# EAGLE design espnative-deadrail-2-g-rendered-poly-via (EAGLE 7.6.0)
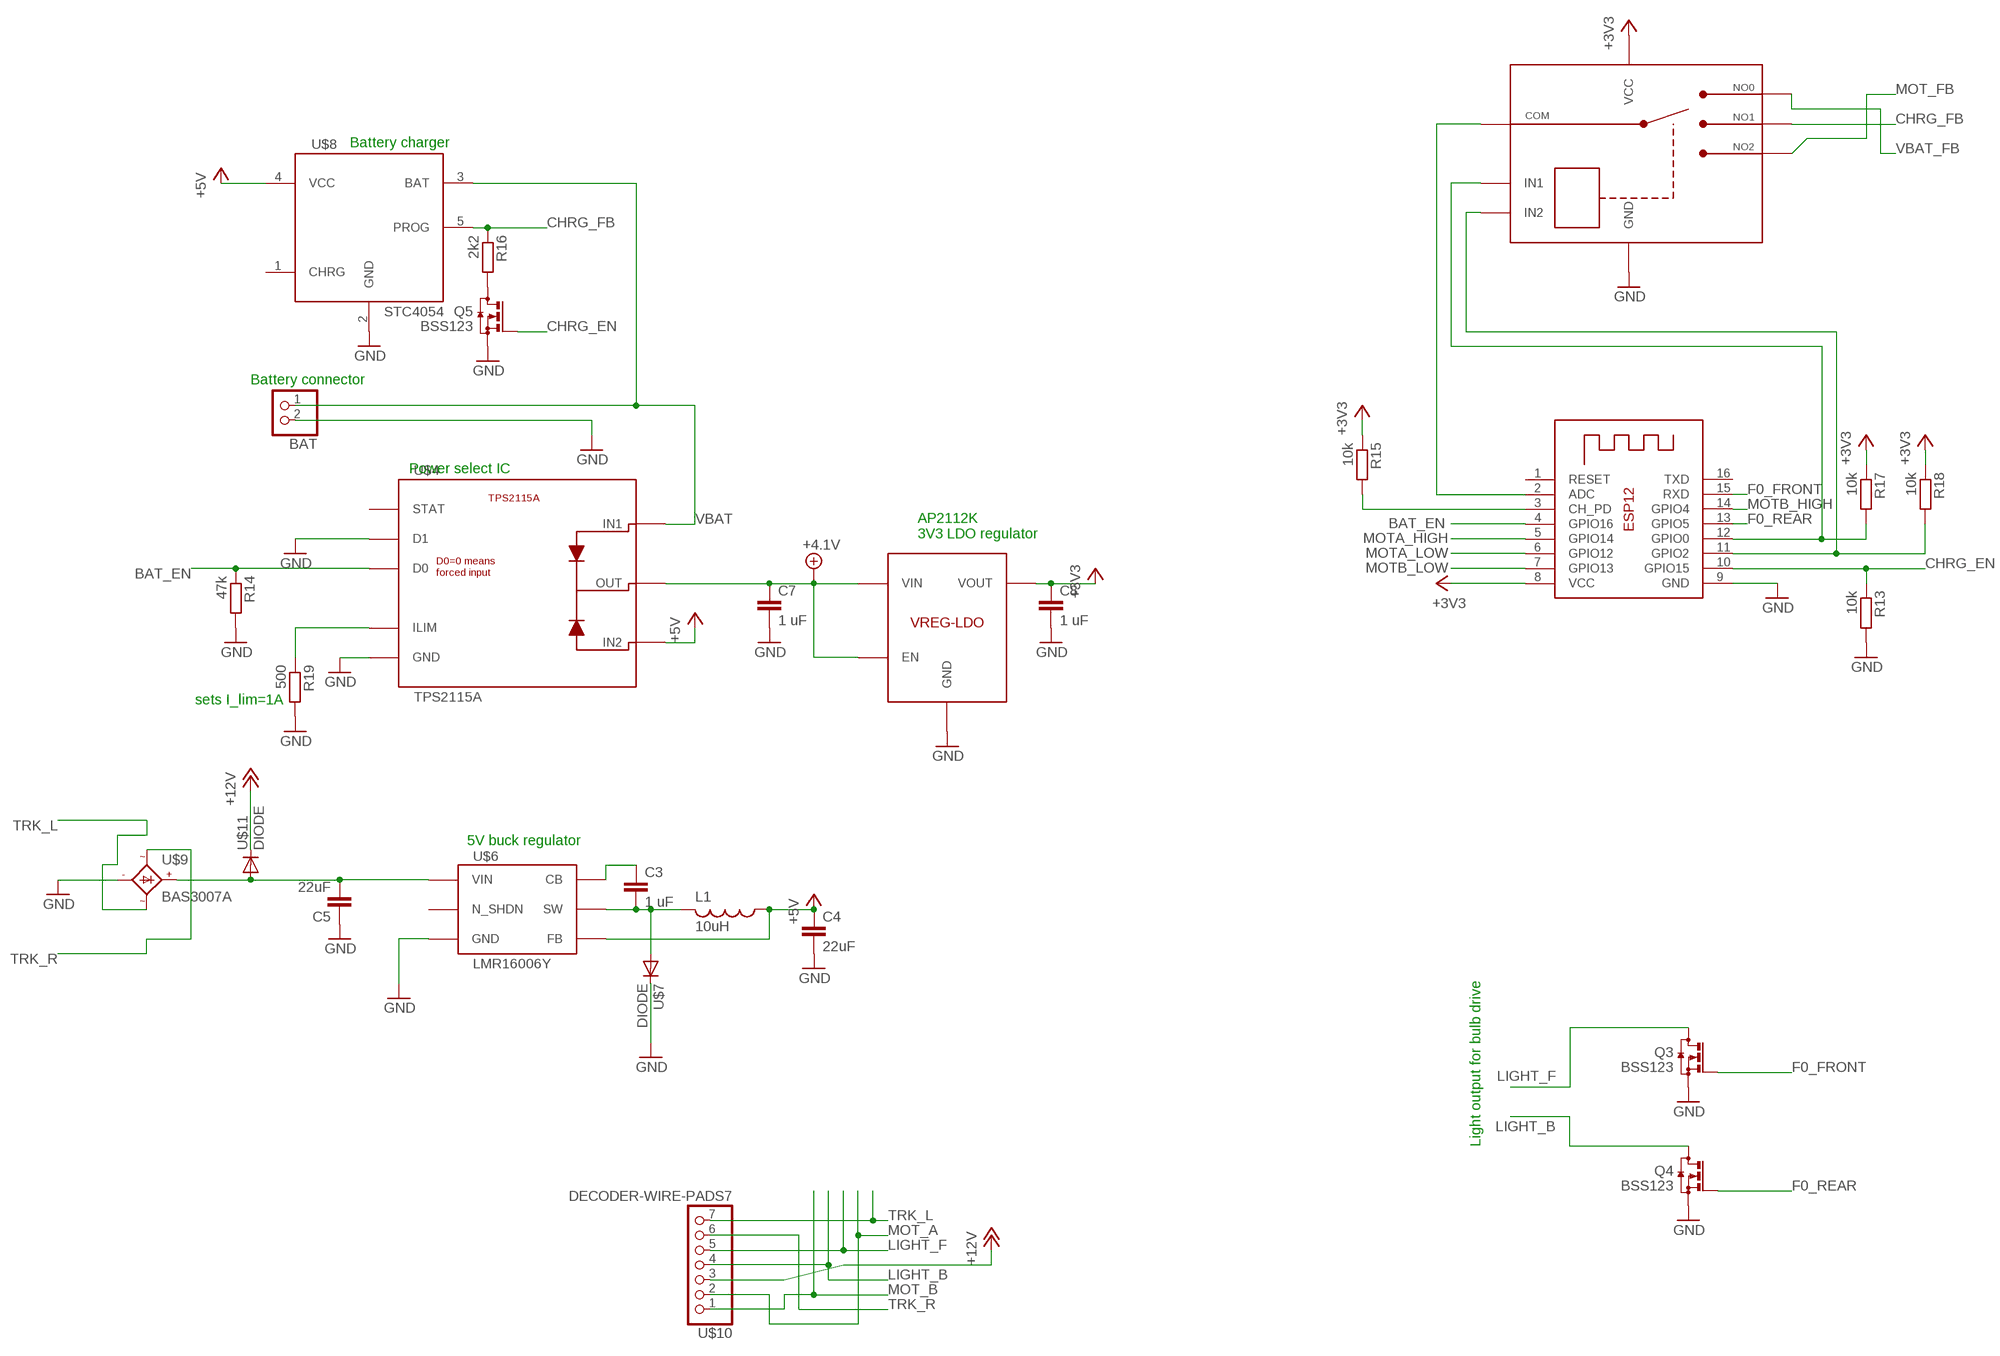
[diagram p0: schematic, sheet 1, part 1 of 2]
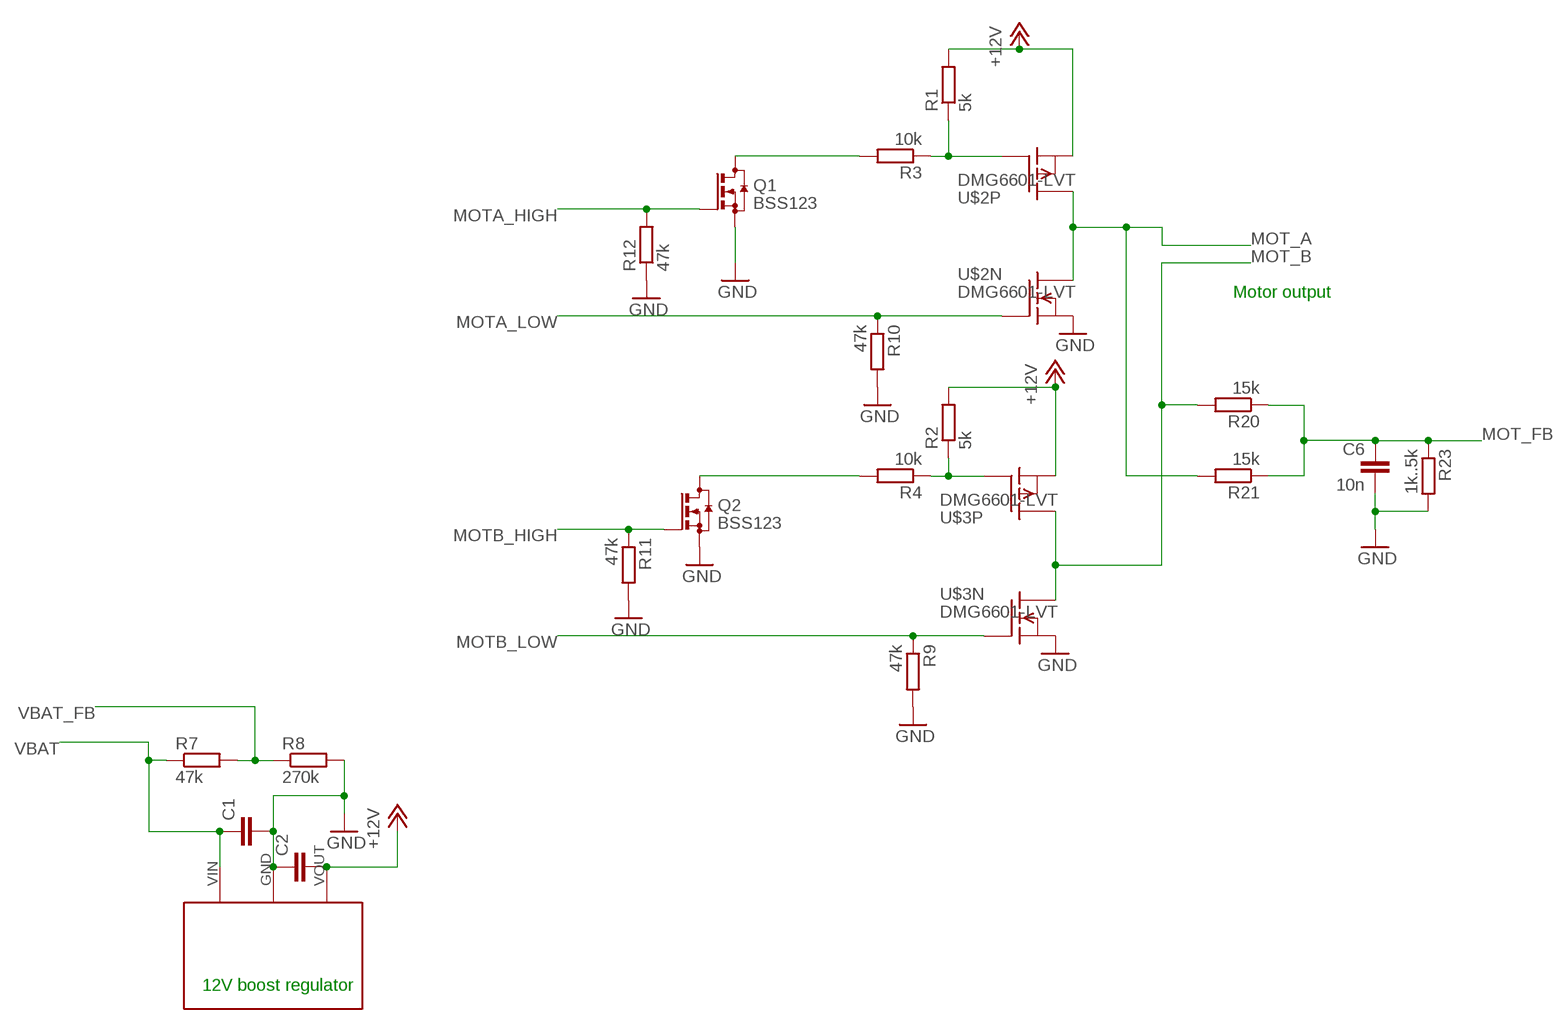
[diagram p1: schematic, sheet 1, part 2 of 2]

## Parts
BAT  JST_2PIN-SMT-RA  [JST-PH-2-SMT-RA]
C1  C-EUC1206  [C1206]
C2  C-EUC1206  [C1206]
C3  1 uF  C-EUC0603  [C0603]
C4  22uF  C-EUC0603  [C0603]
C5  22uF  C-EUC1206  [C1206]
C6  10n  C-EUC0603  [C0603]
C7  1 uF  C-EUC0603  [C0603]
C8  1 uF  C-EUC0603  [C0603]
L1  10uH  FDSD0420  [FDSD0420]
Q1  BSS123  [SOT23]
Q2  BSS123  [SOT23]
Q3  BSS123  [SOT23]
Q4  BSS123  [SOT23]
Q5  BSS123  [SOT23]
R1  5k  R-EU_R0603  [R0603]
R2  5k  R-EU_R0603  [R0603]
R3  10k  R-EU_R0603  [R0603]
R4  10k  R-EU_R0603  [R0603]
R7  47k  R-EU_R0603  [R0603]
R8  270k  R-EU_R0603  [R0603]
R9  47k  R-EU_R0603  [R0603]
R10  47k  R-EU_R0603  [R0603]
R11  47k  R-EU_R0603  [R0603]
R12  47k  R-EU_R0603  [R0603]
R13  10k  R-EU_R0603  [R0603]
R14  47k  R-EU_R0603  [R0603]
R15  10k  R-EU_R0603  [R0603]
R16  2k2  R-EU_R0603  [R0603]
R17  10k  R-EU_R0603  [R0603]
R18  10k  R-EU_R0603  [R0603]
R19  500  R-EU_R0603  [R0603]
R20  15k  R-EU_R0603  [R0603]
R21  15k  R-EU_R0603  [R0603]
R23  1k..5k  R-EU_R0603  [R0603]
U$1  AP2112K-3V3  AP2112K  [SOT23-5L]
U$2  DMG6601-LVT  [TSOT-26]
U$3  DMG6601-LVT  [TSOT-26]
U$4  TPS2115A  [TSSOP-8]
U$5  POLOLU-VREG12  [POLOLU-REGULATOR]
U$6  LMR16006Y  [SOT23-6]
U$7  DIODE  [DIODE-1206]
U$8  STC4054  [SOT23-5L]
U$9  BAS3007A  [SOT143B]
U$10  DECODER-WIRE-PADS7  [DECODER-WIRE-PADS]
U$11  DIODE  [DIODE-1206]
U$12  TS5A3359  [US8]
X1  ESP-12  [ESP-12]

## Nets
+3V3: C8.1 R15.1 R17.1 R18.1 U$1.5(VOUT) U$12.8(VCC) X1.8(VCC)
+4.1V: C7.1 U$1.1(VIN) U$1.3(EN) U$4.7(OUT)
+5V: C4.1 L1.P$1 U$4.6(IN2) U$6.3(FB) U$8.4(VCC)
+12V: C2.2 R1.2 R2.2 U$2.2(P:S) U$3.2(P:S) U$5.VOUT U$10.3 U$11.C
BAT_EN: R14.1 U$4.2(D0) X1.4(GPIO16)
CHRG_EN: Q5.1(G) R13.1 X1.10(GPIO15)
CHRG_FB: R16.1 U$8.5(PROG) U$12.2(NO1)
DCC_VPLUS: C5.2 U$6.5(VIN) U$9.4(+) U$11.A
F0_FRONT: Q3.1(G) X1.15(RXD)
F0_REAR: Q4.1(G) X1.13(GPIO5)
GND: BAT.2 C1.2 C2.1 C4.2 C5.1 C6.2 C7.2 C8.2 Q1.2(S) Q2.2(S) Q3.2(S) Q4.2(S) Q5.2(S) R8.2 R9.2 R10.2 R11.2 R12.1 R13.2 R14.2 R19.2 R23.2 U$1.2(GND) U$2.5(N:S) U$3.5(N:S) U$4.3(D1) U$4.5(GND) U$5.GND U$6.2(GND) U$7.C U$8.2(GND) U$9.1(-) U$12.4(GND) X1.9(GND)
LIGHT_B: Q4.3(D) U$10.4
LIGHT_F: Q3.3(D) U$10.5
MOT_A: R21.2 U$2.4(P:D) U$2.6(N:D) U$10.2
MOT_B: R20.2 U$3.4(P:D) U$3.6(N:D) U$10.1
MOT_FB: C6.1 R20.1 R21.1 R23.1 U$12.3(NO2)
MOTA_HIGH: Q1.1(G) R12.2 X1.5(GPIO14)
MOTA_LOW: R10.1 U$2.1(N:G) X1.6(GPIO12)
MOTB_HIGH: Q2.1(G) R11.1 X1.14(GPIO4)
MOTB_LOW: R9.1 U$3.1(N:G) X1.7(GPIO13)
N$1: U$12.7(COM) X1.2(ADC)
N$2: R1.1 R3.1 U$2.3(P:G)
N$3: Q2.3(D) R4.2
N$4: R2.1 R4.1 U$3.3(P:G)
N$5: C3.2 L1.P$2 U$6.6(SW) U$7.A
N$6: Q1.3(D) R3.2
N$8: C3.1 U$6.1(CB)
N$11: Q5.3(D) R16.2
N$12: R17.2 U$12.6(IN1) X1.12(GPIO0)
N$17: R15.2 X1.3(CH_PD)
N$20: R18.2 U$12.5(IN2) X1.11(GPIO2)
N$22: R19.1 U$4.4(ILIM)
TRK_L: U$9.3(AC2) U$10.7
TRK_R: U$9.2(AC1) U$10.6
VBAT: BAT.1 C1.1 R7.1 U$4.8(IN1) U$5.VIN U$8.3(BAT)
VBAT_FB: R7.2 R8.1 U$12.1(NO0)
Unconnected: U$4.1(STAT) U$6.4(N_SHDN) U$8.1(CHRG) X1.1(RESET) X1.16(TXD)

## Notes on the sheet
- Battery charger
- Battery connector
- Power select IC
- AP2112K
  3V3 LDO regulator
- Motor output
- sets I_lim=1A
- 5V buck regulator
- Light output for bulb drive
- 12V boost regulator

## Library data of the parts
BAT = adafruit:JST_2PIN: JST 2-Pin Connectors of various flavors SMT-RA (S2B-PH-SM4) 4UConnector #17311 SMT (B2B-PH-SM4) THM-RA (S2B-PH) THM (B2B-PH)
C1-C8 = rcl:C-EU: CAPACITOR, European symbol
L1 = trainlib:FDSD0420
Q1-Q5 = transistor-small-signal:BSS123: N-CHANNEL MOS FET
R1-R4 R7-R21 R23 = rcl:R-EU_: RESISTOR, European symbol
U$1 = trainlib:AP2112: 600mA CMOS LDO regulator with enable http://www.diodes.com/_files/datasheets/AP2112.pdf http://www.digikey.com/product-detail/en/diodes-incorporated/AP2112K-3.3TRG1/AP2112K-3.3TRG1DICT-ND/4505257 Package includes sot23-5.
U$2 U$3 = trainlib:DMG6601-LVT: Dual N+P-channel MOSFET. Package: TSOT-26 Vmax=30V N-channel: 55mOhm, 3.8A Imax P-channel: 110mOhm, 2.5A Imax
U$4 = trainlib:TPS2115A: Power source select Ideal diode pair selects power source from two alternatives. Truth table: D0=0 selects fixed input. (D1=0 sleects IN2, D1=1 selects IN1) D0=1 selects auto-input. (D1=0 picks higher voltage, D1=1 sets shutdown) http://www.ti.com/lit/ds/symlink/tps2114a.pdf
U$5 = trainlib:POLOLU-VREG12
U$6 = trainlib:LMR16006Y: Buck regulator with 600mA output current and 2.1MHz fixed frequency. http://www.ti.com/lit/ds/symlink/lmr16006y-q1.pdf Available in sot23-6 package.
U$7 U$11 = trainlib:DIODE
U$8 = trainlib:STC4054: Single-cell Li-ion battery charger Configurable maximum current Lithium battery charger. The maximum charging current can be configured with a resistor, up to 800 mA. Charge can be enabled or inhibited. http://www.st.com/content/ccc/resource/technical/document/datasheet/df/b9/e6/5b/ec/92/45/ed/CD00132951.pdf/files/CD00132951.pdf/jcr:content/translations/en.CD00132951.pdf
U$9 = trainlib:BAS3007A: Bridge rectifier 30V typical voltage loss 0.5V, current capability up to 0.9A datasheet link <http://www.infineon.com/dgdl/bas3007aseries.pdf?folderId=db3a304313d846880113def5812204a1&fileId=db3a3043156fd5730115a286aa19083b>
U$10 = trainlib:DECODER-WIRE-PADS7
U$12 = trainlib:TS5A3359: SP3T analog mux 1-Ohm 3-way multiplexer, controlled by two input lines. http://www.ti.com/lit/ds/symlink/ts5a3359.pdf
X1 = trainlib:ESP-12

## Board
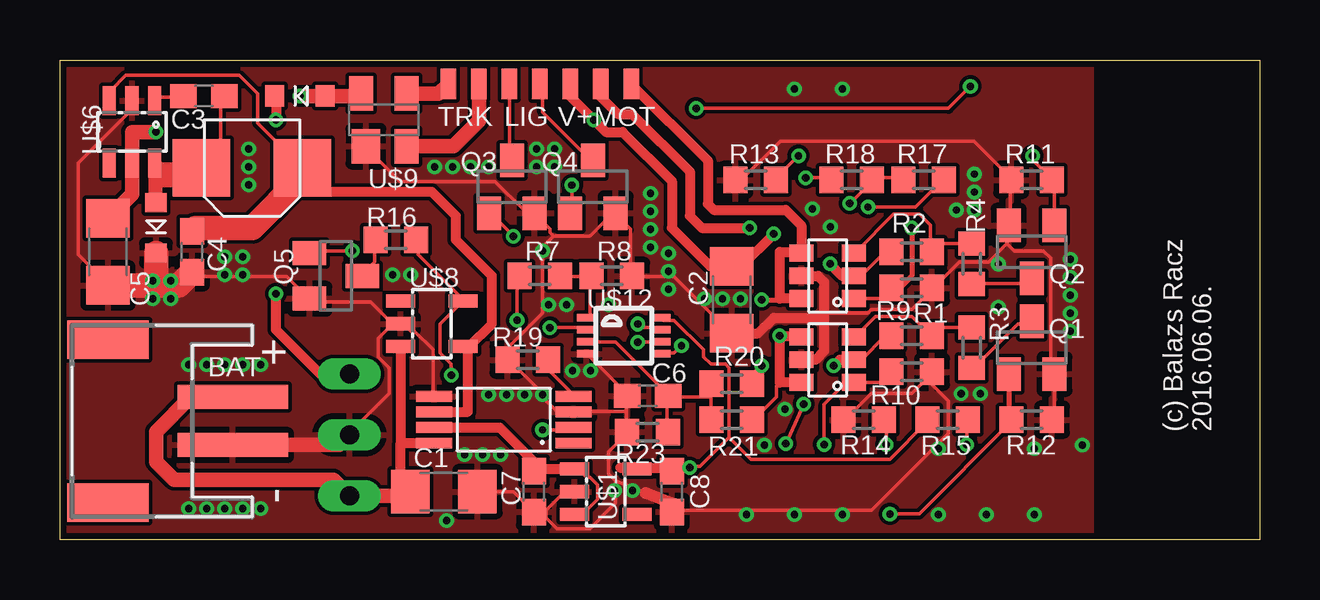
[diagram p2: board, top side]
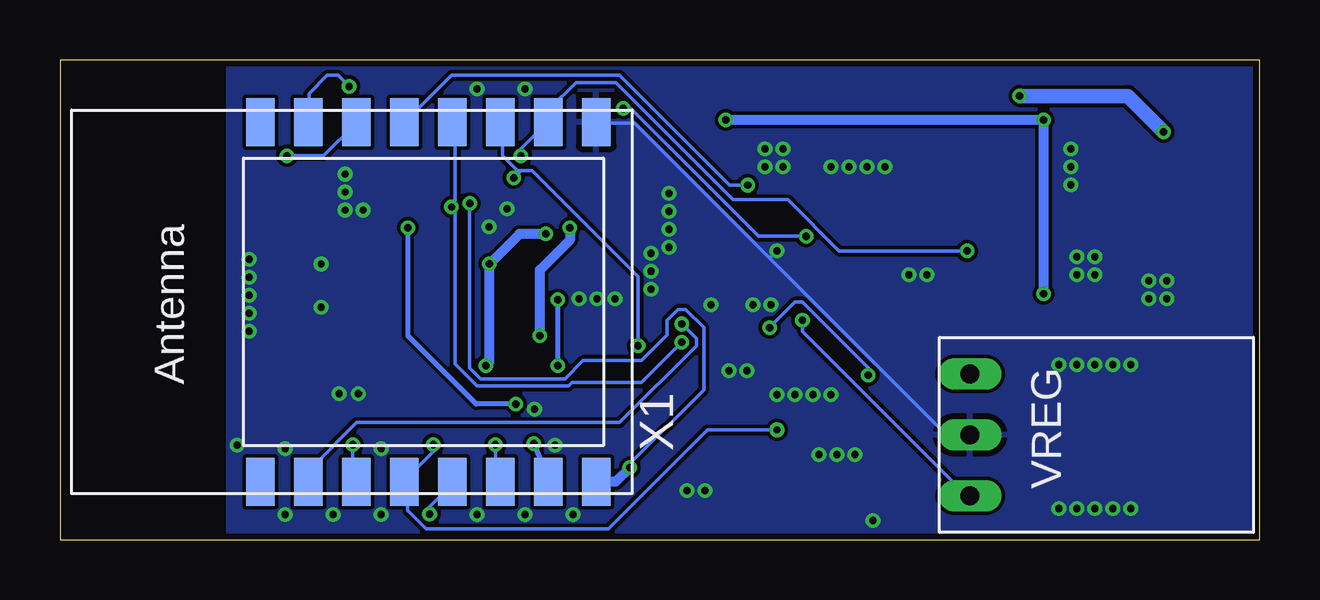
[diagram p3: board, bottom side, seen from below]

Size 50 x 20 mm. Coordinates in mm from the lower left corner, seen from the top.
Outline: 0,0 0,20 50,20 50,0 0,0
Copper layers (1*16): Top 0.035mm / dielectric 1.5mm / Bottom 0.035mm
Design rules "SeeedStudio_2layer_DRU_no_angle_20140221": minimum track width 6mil, minimum drill 12mil, track to track 6mil, track to pad 6mil, pad to pad 6mil, via to via 6mil, smd to smd 0mil, copper to edge 10mil, drill to drill 10mil, minimum pad ring 10mil, minimum via ring 6mil, stop-mask expansion 2mil, vias tented up to drill 100mil, thermal gap 10mil

### Footprints (pad centres in the part's own frame; a part is rotated, then mirrored left to right if it is on the bottom)
JST-PH-2-SMT-RA = smd 1 x 4.6: 1 1,-3.7; 2 -1,-3.7 | smd 1.6 x 3.4: NC1 -3.4,1.5; NC2 3.4,1.5
C1206 = smd 1.6 x 1.8: 1 -1.4,0; 2 1.4,0
C0603 = smd 1.1 x 1: 1 -0.85,0; 2 0.85,0
FDSD0420 = smd 2.4 x 2.4: P$1 -2.1,0; P$2 2.1,0
SOT23 = smd 1 x 1.4: 1 -0.95,-1.1; 2 0.95,-1.1; 3 0,1.1
R0603 = smd 1 x 1.1: 1 -0.85,0; 2 0.85,0
SOT23-5L = smd 0.55 x 1.2: 1 -0.95,-1.3; 2 0,-1.3; 3 0.95,-1.3; 4 0.95,1.3; 5 -0.95,1.3
TSOT-26 = smd 0.7 x 1: 1 -0.95,-1.1; 2 0,-1.1; 3 0.95,-1.1; 4 0.95,1.1; 5 0,1.1; 6 -0.95,1.1
TSSOP-8 = smd 1.5 x 0.45: 1 -2.9,0.975; 2 -2.9,0.325; 3 -2.9,-0.325; 4 -2.9,-0.975; 5 2.9,-0.975; 6 2.9,-0.325; 7 2.9,0.325; 8 2.9,0.975
POLOLU-REGULATOR = drill 0.8 long: GND 4.064,1.27; VIN 6.604,1.27; VOUT 1.524,1.27
SOT23-6 = smd 0.55 x 1.2: 1 -0.95,-1.3; 2 0,-1.3; 3 0.95,-1.3; 4 0.95,1.3; 5 0,1.3; 6 -0.95,1.3
DIODE-1206 = smd 0.8 x 0.9: A 1.05,0; C -1.05,0
SOT143B = smd 1.2 x 1.44: 1 -0.75,-1.1 | smd 1 x 1.44: 2 0.95,-1.1; 3 0.95,1.1; 4 -0.95,1.1
DECODER-WIRE-PADS = smd 1.27 x 0.635: 1 0,3.81; 2 0,2.54; 3 0,1.27; 4 0,0; 5 0,-1.27; 6 0,-2.54; 7 0,-3.81
US8 = smd 0.3 x 0.8: 1 -0.75,-1.55; 2 -0.25,-1.55; 3 0.25,-1.55; 4 0.75,-1.55; 5 0.75,1.55; 6 0.25,1.55; 7 -0.25,1.55; 8 -0.75,1.55
ESP-12 = smd 2 x 1.2: 1 -7.5,4.5; 2 -7.5,2.5; 3 -7.5,0.5; 4 -7.5,-1.5; 5 -7.5,-3.5; 6 -7.5,-5.5; 7 -7.5,-7.5; 8 -7.5,-9.5; 9 7.5,-9.5; 10 7.5,-7.5; 11 7.5,-5.5; 12 7.5,-3.5; 13 7.5,-1.5; 14 7.5,0.5; 15 7.5,2.5; 16 7.5,4.5

### Placement (x,y rotation side)
BAT  3.5,4.94 90 top
C1  16,2 0 top
C2  28,10 90 top
C3  6,18.5 0 top
C4  5.5,12 270 top
C5  2,12 90 top
C6  24.5,6 180 top
C7  19.75,2 270 top
C8  25.5,2 270 top
L1  8,15.5 180 top
Q1  40.5,8 0 top
Q2  40.5,12 180 top
Q3  18.84,14.71 0 top
Q4  22.21,14.71 0 top
Q5  11.5,11 270 top
R1  35.5,8.5 180 top
R2  35.5,12 180 top
R3  38,8 270 top
R4  38,11.5 270 top
R7  20,11 0 top
R8  23,11 0 top
R9  35.5,10.5 0 top
R10  35.5,7 0 top
R11  40.5,15 180 top
R12  40.5,5 180 top
R13  29,15 180 top
R14  33.5,5 180 top
R15  37,5 0 top
R16  14,12.5 180 top
R17  36,15 0 top
R18  33,15 180 top
R19  19.5,7.5 180 top
R20  28,6.5 0 top
R21  28,5 0 top
R23  24.49,4.48 180 top
U$1  22.75,2 270 top
U$2  32,7.5 90 top
U$3  32,11 90 top
U$4  18.5,5 180 top
U$5  13.34,8.43 270 bottom
U$6  3,17 180 top
U$7  4,13 90 top
U$8  15.5,9 270 top
U$9  13.5,17.5 0 top
U$10  20,19 270 top
U$11  10,18.5 0 top
U$12  23.5,8.5 270 top
X1  37.15,9.91 90 bottom

### Tracks (layer width: path | path; a pad name or v marks a point on that pad's centre or on a via)
+3V3  (via drill 0.3)
  Top 0.152: R17.1 35.05,15.09 33.98,15.09 R18.1 33.83,14.94 v32.92,14.02 | 27.89,4.27 27.89,7.16 27.74,7.32 27.13,7.32 26.82,7.62 26.82,7.92 25.6,9.14 25.15,9.14 U$12.8 | 27.89,4.27 26.67,3.05 26.36,3.05 v26.25,3 | C8.1 25.6,2.9 25.6,3 | 27.89,4.27 28.8,3.35 34.59,3.35 36.12,4.88 R15.1
  Top 0.406: U$1.5 23.35,3 25.6,3 v26.25,3
  Bottom 0.152: v32.92,14.02 32.92,7.16 32.46,6.71 28.96,6.71 28.19,7.47 25.76,7.47 24.69,8.53 24.69,9.14 24.23,9.6 23.93,9.6 23.16,8.84 23.16,6.25 26.21,3.2 v26.25,3
  Bottom 0.406: v26.25,3 26.84,2.41 X1.8
+4.1V
  Top 0.152: C7.1 19.81,2.9 19.81,3.05 19.88,3.12 | U$1.1 21.64,2.9 21.95,2.59 22.1,2.59 22.4,2.29 22.4,1.68 21.79,1.07 21.49,1.07 U$1.3
  Top 0.406: U$4.7 18.32,4.67 19.88,3.12 20.05,2.95 U$1.1
+5V
  Top 0.152: U$6.3 2.13,18.44 2.13,18.75 2.74,19.36 7.47,19.36 8.23,18.59 8.23,17.37 9.75,15.85 L1.P$1
  Top 0.406: U$4.6 17,5.33 17,8.05 U$8.4 17.05,8.05 18,9 18,11 16.5,12.5 16.5,13.5 15.5,14.5 11.1,14.5 L1.P$1
  Top 1.016: C4.1 5.65,13 8,13 10.1,15.1 L1.P$1
+12V  (via drill 0.3)
  Top 0.152: R1.2 34.59,8.38 34.29,8.38 33.53,7.62 33.22,7.62 U$2.2 | R2.2 34.59,11.89 34.29,11.89 33.53,11.12 33.22,11.12 U$3.2
  Top 0.406: v29.75,12.75 28.4,11.4 C2.2 27.1,11.4 25.5,13 25.5,14.95 23.45,17 22.75,17 v22.25,17.5 21.27,18.48 U$10.3 | v32.1,11.5 32.6,11 U$3.2 | U$2.2 32.5,7.5 v32.25,7.25 | U$11.C 9,18.45 v9,17.5 | U$5.VOUT 10.84,6.91 9,8.75 v9,10.25
  Bottom 0.406: v29.75,12.75 30.85,12.75 v32.1,11.5 32.1,7.4 v32.25,7.25 | v22.25,17.5 v9,17.5 v9,10.25
BAT_EN  (via drill 0.3)
  Top 0.152: v34.44,3.96 34.44,4.88 R14.1 | v20.12,4.57 21.34,4.57 U$4.2
  Bottom 0.152: v34.44,3.96 34.44,3.66 35.66,2.44 X1.4 35.51,2.29 35.51,1.22 34.75,0.46 27.13,0.46 23.01,4.57 v20.12,4.57
CHRG_EN  (via drill 0.3)
  Top 0.152: v30.79,16 29.87,15.09 R13.1 | v12.19,12.04 10.52,12.04 Q5.1
  Bottom 0.152: v30.79,16 30.79,16.31 29.72,17.37 X1.10 29.57,17.53 29.57,17.98 28.5,19.05 26.82,19.05 21.95,14.17 19.66,14.17 17.53,12.04 v12.19,12.04
CHRG_FB  (via drill 0.3)
  Top 0.152: v20.42,8.84 21.95,8.84 U$12.2 | v16.31,6.86 16.31,7.32 15.85,7.77 15.85,8.99 16.76,9.91 U$8.5 16.76,10.06 14.94,11.89 14.94,12.5 R16.1
  Bottom 0.152: v20.42,8.84 19.36,9.91 19.05,9.91 16.31,7.16 v16.31,6.86
DCC_VPLUS  (via drill 0.3)
  Top 0.61: C5.2 3,14.4 U$6.5 3,17 v4,17 | U$9.4 12.45,18.5 U$11.A v10,18.5
  Bottom 0.61: v10,18.5 5.5,18.5 v4,17
F0_FRONT  (via drill 0.3)
  Top 0.152: v18.9,12.65 17.98,13.56 Q3.1 | v26.52,17.98 37.03,17.98 v37.95,18.9
  Bottom 0.152: v18.9,12.65 20.88,12.65 26.21,17.98 v26.52,17.98 | v37.95,18.9 38.41,19.36 38.86,19.36 39.62,18.59 39.62,17.53 X1.15
F0_REAR  (via drill 0.3)
  Top 0.152: v21.34,14.78 21.34,13.72 Q4.1
  Bottom 0.152: v21.34,14.78 22.1,14.78 26.67,19.36 33.68,19.36 35.51,17.53 X1.13
GND  (via drill 0.3)
  Top 0.152: U$6.2 2.9,18.29 2.9,17.83 0.76,15.7 0.76,11.89 1.68,10.97 C5.1 | U$8.2 14.33,8.99 14.63,8.69 14.78,8.69 15.54,7.92 15.54,6.1 U$4.5 | 13.72,9.14 12.95,9.91 10.52,9.91 Q5.2 10.36,10.06 9.45,10.97 5.94,10.97 C4.2 | 13.72,9.14 14.17,9.14 U$8.2 | 13.72,9.14 13.72,8.84 13.26,8.38 13.26,7.62 13.72,7.16 13.72,6.1 12.19,4.57 U$5.GND | 13.72,9.14 U$8.2 | 20.27,1.22 19.81,1.22 C7.2 19.66,1.22 18.9,1.98 17.53,1.98 C1.2 | 20.27,1.22 21.03,1.98 21.34,1.98 U$1.2 | 36.12,6.71 36.27,6.86 R10.2 36.12,6.71 | 36.12,6.71 35.51,6.1 33.83,6.1 32.77,5.03 R14.2 | U$12.4 22.1,7.62 23.62,6.1 C6.2 23.62,5.94 23.62,5.33 | 23.62,5.33 23.62,4.57 R23.2 23.62,4.42 22.86,3.66 22.86,2.74 23.16,2.44 | 25.65,1.47 25.45,1.22 C8.2 25.6,1.22 33.83,1.22 37.03,4.42 37.03,5.79 36.12,6.71 | 23.16,2.44 24.43,1.94 | 23.62,5.33 21.49,5.33 U$4.3 21.34,5.33 20.73,5.33 20.27,5.79 20.27,5.94 18.75,7.47 R19.2 18.75,7.62 18.75,8.08 20.12,9.45 v20.12,12.04 20.12,12.19 20.57,12.65 | 20.27,1.22 20.27,0.91 20.73,0.46 22.1,0.46 23.16,1.52 23.16,2.44 | 20.57,12.65 20.42,12.8 20.42,12.95 19.81,13.56 Q3.2 19.66,13.72 19.36,13.72 18.14,14.94 14.17,14.94 12.8,16.31 U$9.1 | 20.57,12.65 22.1,12.65 23.01,13.56 Q4.2 23.16,13.56 23.77,12.95 23.77,11.12 R8.2 23.93,10.97 25.6,10.97 27.89,8.69 C2.1 | R13.2 28.19,15.09 28.5,15.09 30.02,16.61 38.1,16.61 39.62,15.09 R11.2 39.62,14.94 39.62,13.11 Q2.2 39.47,12.95 39.47,12.34 | R12.1 41.45,5.03 41.45,6.86 Q1.2 41.3,7.01 41.3,11.73 41,12.04 39.78,12.04 39.47,12.34 | 39.47,12.34 38.71,11.58 37.49,11.58 36.42,10.52 R9.2 36.27,10.36 35.51,9.6 33.83,9.6 33.68,9.45 31.85,9.45
  Top 0.406: C2.1 29.1,8.6 29.75,9.25 31.85,9.25 | 31.85,9.25 31.85,7.85 31.5,7.5 U$2.5 | U$3.5 31.6,11 31.85,10.75 31.85,9.45 31.85,9.25
  Top 0.508: 24.43,1.94 25.65,1.47
  Top 0.61: BAT.2 11.64,3.94 U$5.GND
  Top 1.016: C4.2 4.95,10.6 4,10.6 | 4,10.6 C5.1 | U$7.C 4,10.6
  Bottom 0.152: 20.42,11.73 13.11,4.42 12.19,4.42 U$5.GND | 20.42,11.73 26.06,17.37 27.58,17.37 X1.9 | v20.12,12.04 20.42,11.73
  other vias: 7.87,16.29 7.87,15.54 7.87,14.79 6.87,11.79 7.62,11.79 7.62,11.04 3.87,10.79 5.37,7.29 6.12,7.29 6.87,7.29 7.62,7.29 8.37,7.29 13.87,11.04 14.62,11.04 18.62,6.04 19.37,6.04 20.12,6.04 23.12,2.04 23.87,2.04 32.62,1.04 30.62,1.04 28.62,1.04 38.62,1.04 40.62,1.04 36.62,1.04 40.62,3.79 36.62,3.79 29.37,3.94 42.62,3.94 42.12,8.69 42.12,9.44 42.12,10.19 42.12,10.94 42.12,11.69 24.62,14.44 24.62,13.69 24.62,12.94 24.62,12.19 25.37,11.94 25.37,11.19 25.37,10.44 21.37,7.04 22.12,7.04 20.37,9.79 21.12,9.79 22.87,9.79 15.62,15.54 16.37,15.54 17.12,15.54 17.87,15.54 19.87,16.29 20.62,16.29 19.87,15.54 20.62,15.54 5.37,1.29 6.12,1.29 6.87,1.29 8.37,1.29 7.62,1.29 17.87,6.04 17.62,3.54 18.37,3.54 16.12,0.79 16.87,3.54 30.62,18.79 32.62,18.79 30.22,5.44 6.87,11.04 4.62,10.79 3.87,10.04 4.62,10.04 28.37,10.04 27.62,10.04 26.87,10.04 32.12,13.04 31.37,13.79 39.12,9.69 39.12,11.49 37.57,6.09 38.37,6.09 38.12,15.24 38.12,14.49 38.12,13.74 37.37,13.74
  pour Top: 0,20 0,0 43,0 43,20 42.75,20
  pour Bottom: 43,20 43,0 0,0 0,20 0.25,20
LIGHT_B
  Top 0.152: U$10.4 20.12,18.9 20.12,17.83 22.1,15.85 Q4.3
LIGHT_F
  Top 0.152: U$10.5 18.75,18.9 18.75,15.85 Q3.3
MOT_A  (via drill 0.3)
  Top 0.152: R21.2 28.96,5.03 29.87,5.94 29.87,6.4 30,6.55
  Top 0.406: U$2.6 30,6.55 v30,8.5 30.9,8.5 U$2.4 | U$10.2 22.54,18.46 23.25,17.75 23.85,17.75 26.25,15.35 26.25,13.5 26.75,13 v28.75,13
  Bottom 0.406: v28.75,13 28.75,12.5 30,11.25 v30,8.5
MOT_B  (via drill 0.3)
  Top 0.203: R20.2 28.85,6.85 v29.25,7.25 | v29.25,10 29.95,10 30,10.05
  Top 0.406: U$3.6 30,10.05 30,12 30.9,12 U$3.4 30.9,13.1 30.25,13.75 27.25,13.75 27,14 27,15.81 U$10.1
  Bottom 0.203: v29.25,7.25 v29.25,10
MOT_FB
  Top 0.152: 27.13,5.94 27.13,6.4 R20.1 | 27.13,5.94 27.13,5.03 R21.1 | U$12.3 22.1,8.23 23.16,8.23 25.3,6.1 C6.1 | R23.1 25.3,4.57 25.3,5.94 C6.1 | 27.13,5.94 25.45,5.94 C6.1
MOTA_HIGH  (via drill 0.3)
  Top 0.152: v34.59,1.07 35.81,1.07 39.62,4.88 R12.2
  Top 0.203: Q1.1 39.55,5.1 R12.2
  Bottom 0.152: v34.59,1.07 34.59,1.37 33.68,2.29 X1.5
MOTA_LOW  (via drill 0.3)
  Top 0.152: R10.1 34.59,6.86 34.29,6.55 33.22,6.55 U$2.1 33.07,6.4 32.61,6.4 31.85,5.64 v31.85,3.96
  Bottom 0.152: v31.85,3.96 31.85,2.59 31.7,2.44 X1.6
MOTB_HIGH  (via drill 0.3)
  Top 0.152: Q2.1 41.45,14.94 R11.1 41.3,15.09 40.54,15.85 v40.54,16
  Bottom 0.152: v40.54,16 39.01,16 37.64,17.37 X1.14
MOTB_LOW  (via drill 0.3)
  Top 0.152: v30.25,4 v31,5.65 | U$3.1 33.22,10.06 34.29,10.06 34.59,10.36 R9.1
  Top 0.203: v35.5,13 35.5,11 35,10.5 R9.1
  Bottom 0.203: X1.7 29.65,2.65 v30.25,4 | v31,5.65 32.65,5.65 35.5,8.5 v35.5,13
N$1  (via drill 0.3)
  Top 0.152: v24.08,8.99 24.23,8.84 24.99,8.84 U$12.7
  Bottom 0.152: v24.08,8.99 23.47,8.38 23.47,8.08 26.67,4.88 37.64,4.88 39.62,2.9 39.62,2.44 X1.2
N$2
  Top 0.152: U$2.3 33.22,8.53 33.98,9.3 35.51,9.3 36.27,8.53 R1.1 36.42,8.53 36.73,8.84 37.95,8.84 R3.1
N$3
  Top 0.152: R4.2 38.1,10.67 40.23,10.67 40.39,10.82 Q2.3
N$4
  Top 0.152: 36.27,12.34 36.27,12.04 R2.1 36.27,12.34 | 36.27,12.34 36.27,13.11 35.81,13.56 34.75,13.56 33.22,12.04 U$3.3 | 36.27,12.34 37.95,12.34 R4.1
N$5
  Top 0.152: C3.2 6.71,18.44 6.71,16.46 5.94,15.7 L1.P$2
  Top 0.508: U$7.A 3.95,14.1 U$6.6 4.15,15.5 L1.P$2 5.4,15 | 4,15 4,14
  Top 0.61: 5.4,15 4,15
N$6
  Top 0.152: R3.2 38.1,7.16 39.93,8.99 40.39,8.99 Q1.3
N$8
  Top 0.152: C3.1 5.03,18.44 3.96,18.44 U$6.1
N$11
  Top 0.152: R16.2 13.11,12.5 13.11,11.58 12.65,11.12 Q5.3
N$12  (via drill 0.3)
  Top 0.152: v24.08,8.23 24.99,8.23 U$12.6 | v33.68,13.87 35.66,13.87 36.73,14.94 R17.2
  Bottom 0.152: v24.08,8.23 25.76,6.55 28.65,6.55 28.8,6.4 32.61,6.4 33.53,7.32 33.53,13.87 | 33.53,13.87 33.53,17.37 X1.12 | 33.53,13.87 v33.68,13.87
N$17  (via drill 0.3)
  Top 0.152: v37.8,3.96 37.8,4.88 R15.2
  Bottom 0.152: v37.8,3.96 37.8,2.44 X1.3
N$20  (via drill 0.3)
  Top 0.152: v25.91,8.08 25.6,7.77 25.15,7.77 U$12.5 | v31.09,15.09 32,15.09 R18.2
  Bottom 0.152: v25.91,8.08 25.91,10.97 30.33,15.39 30.79,15.39 | 30.79,15.39 30.94,15.39 31.55,16 31.55,17.37 X1.11 | 30.79,15.39 v31.09,15.09
N$22
  Top 0.152: R19.1 20.42,7.47 20.42,7.01 21.34,6.1 U$4.4
TRK_L
  Top 0.61: U$9.3 15.79,18.6 U$10.7
TRK_R
  Top 0.61: U$9.2 16.4,16.4 17.46,17.46 U$10.6
VBAT  (via drill 0.3)
  Top 0.152: v19.05,9.14 19.05,10.97 R7.1
  Top 0.406: U$8.3 14.2,4.03 | 14.2,4.03 U$4.8 | C1.1 14.2,2 14.2,4.03
  Top 0.61: BAT.1 5.44,5.94 4,4.5 4,3.25 4.75,2.5 11.4,2.5 U$5.VIN 14.43,1.83 C1.1
  Bottom 0.152: v19.05,9.14 19.05,8.69 12.19,1.83 U$5.VIN
VBAT_FB
  Top 0.152: 22.1,10.97 22.1,9.3 U$12.1 | 22.1,10.97 20.88,10.97 R7.2 | 22.1,10.97 R8.1

### Text on the board
tNames: TRK | LIG | V+ | MOT | (c) Balazs Racz / 2016.06.06.